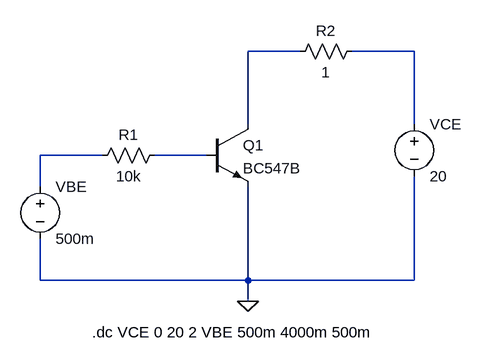
[diagram p0: schematic bjt output characteristics.asc]
bjt output characteristics.asc, the LTspice schematic file:
Version 4.1
SHEET 1 880 680
WIRE 240 0 160 0
WIRE 416 0 320 0
WIRE 160 112 160 0
WIRE 416 112 416 0
WIRE -64 160 -160 160
WIRE 96 160 16 160
WIRE -160 208 -160 160
WIRE -160 352 -160 288
WIRE 160 352 160 208
WIRE 160 352 -160 352
WIRE 416 352 416 192
WIRE 416 352 160 352
WIRE 160 384 160 352
FLAG 160 384 0
SYMBOL npn 96 112 R0
SYMATTR InstName Q1
SYMATTR Value BC547B
SYMBOL voltage -160 192 R0
SYMATTR InstName VBE
SYMATTR Value 500m
SYMBOL res 32 144 R90
WINDOW 0 0 56 VBottom 2
WINDOW 3 32 56 VTop 2
SYMATTR InstName R1
SYMATTR Value 10k
SYMBOL voltage 416 96 R0
SYMATTR InstName VCE
SYMATTR Value 20
SYMBOL res 336 -16 R90
WINDOW 0 0 56 VBottom 2
WINDOW 3 32 56 VTop 2
SYMATTR InstName R2
SYMATTR Value 1
TEXT -80 432 Left 2 !.dc VCE 0 20 2 VBE 500m 4000m 500m

The netlist it stands for:
* bjt output characteristics.asc
Q1 N001 N004 0 0 BC547B
VBE N003 0 500m
R1 N004 N003 10k
VCE N002 0 20
R2 N002 N001 1
.model NPN NPN
.model PNP PNP
.lib standard.bjt
.dc VCE 0 20 2 VBE 500m 4000m 500m
.backanno
.end